# Altium schematic sheet SEC_3002_HL_Loop1.SchDoc
size 419 x 297 mm; SheetNumber: 3; SheetTotal: 4
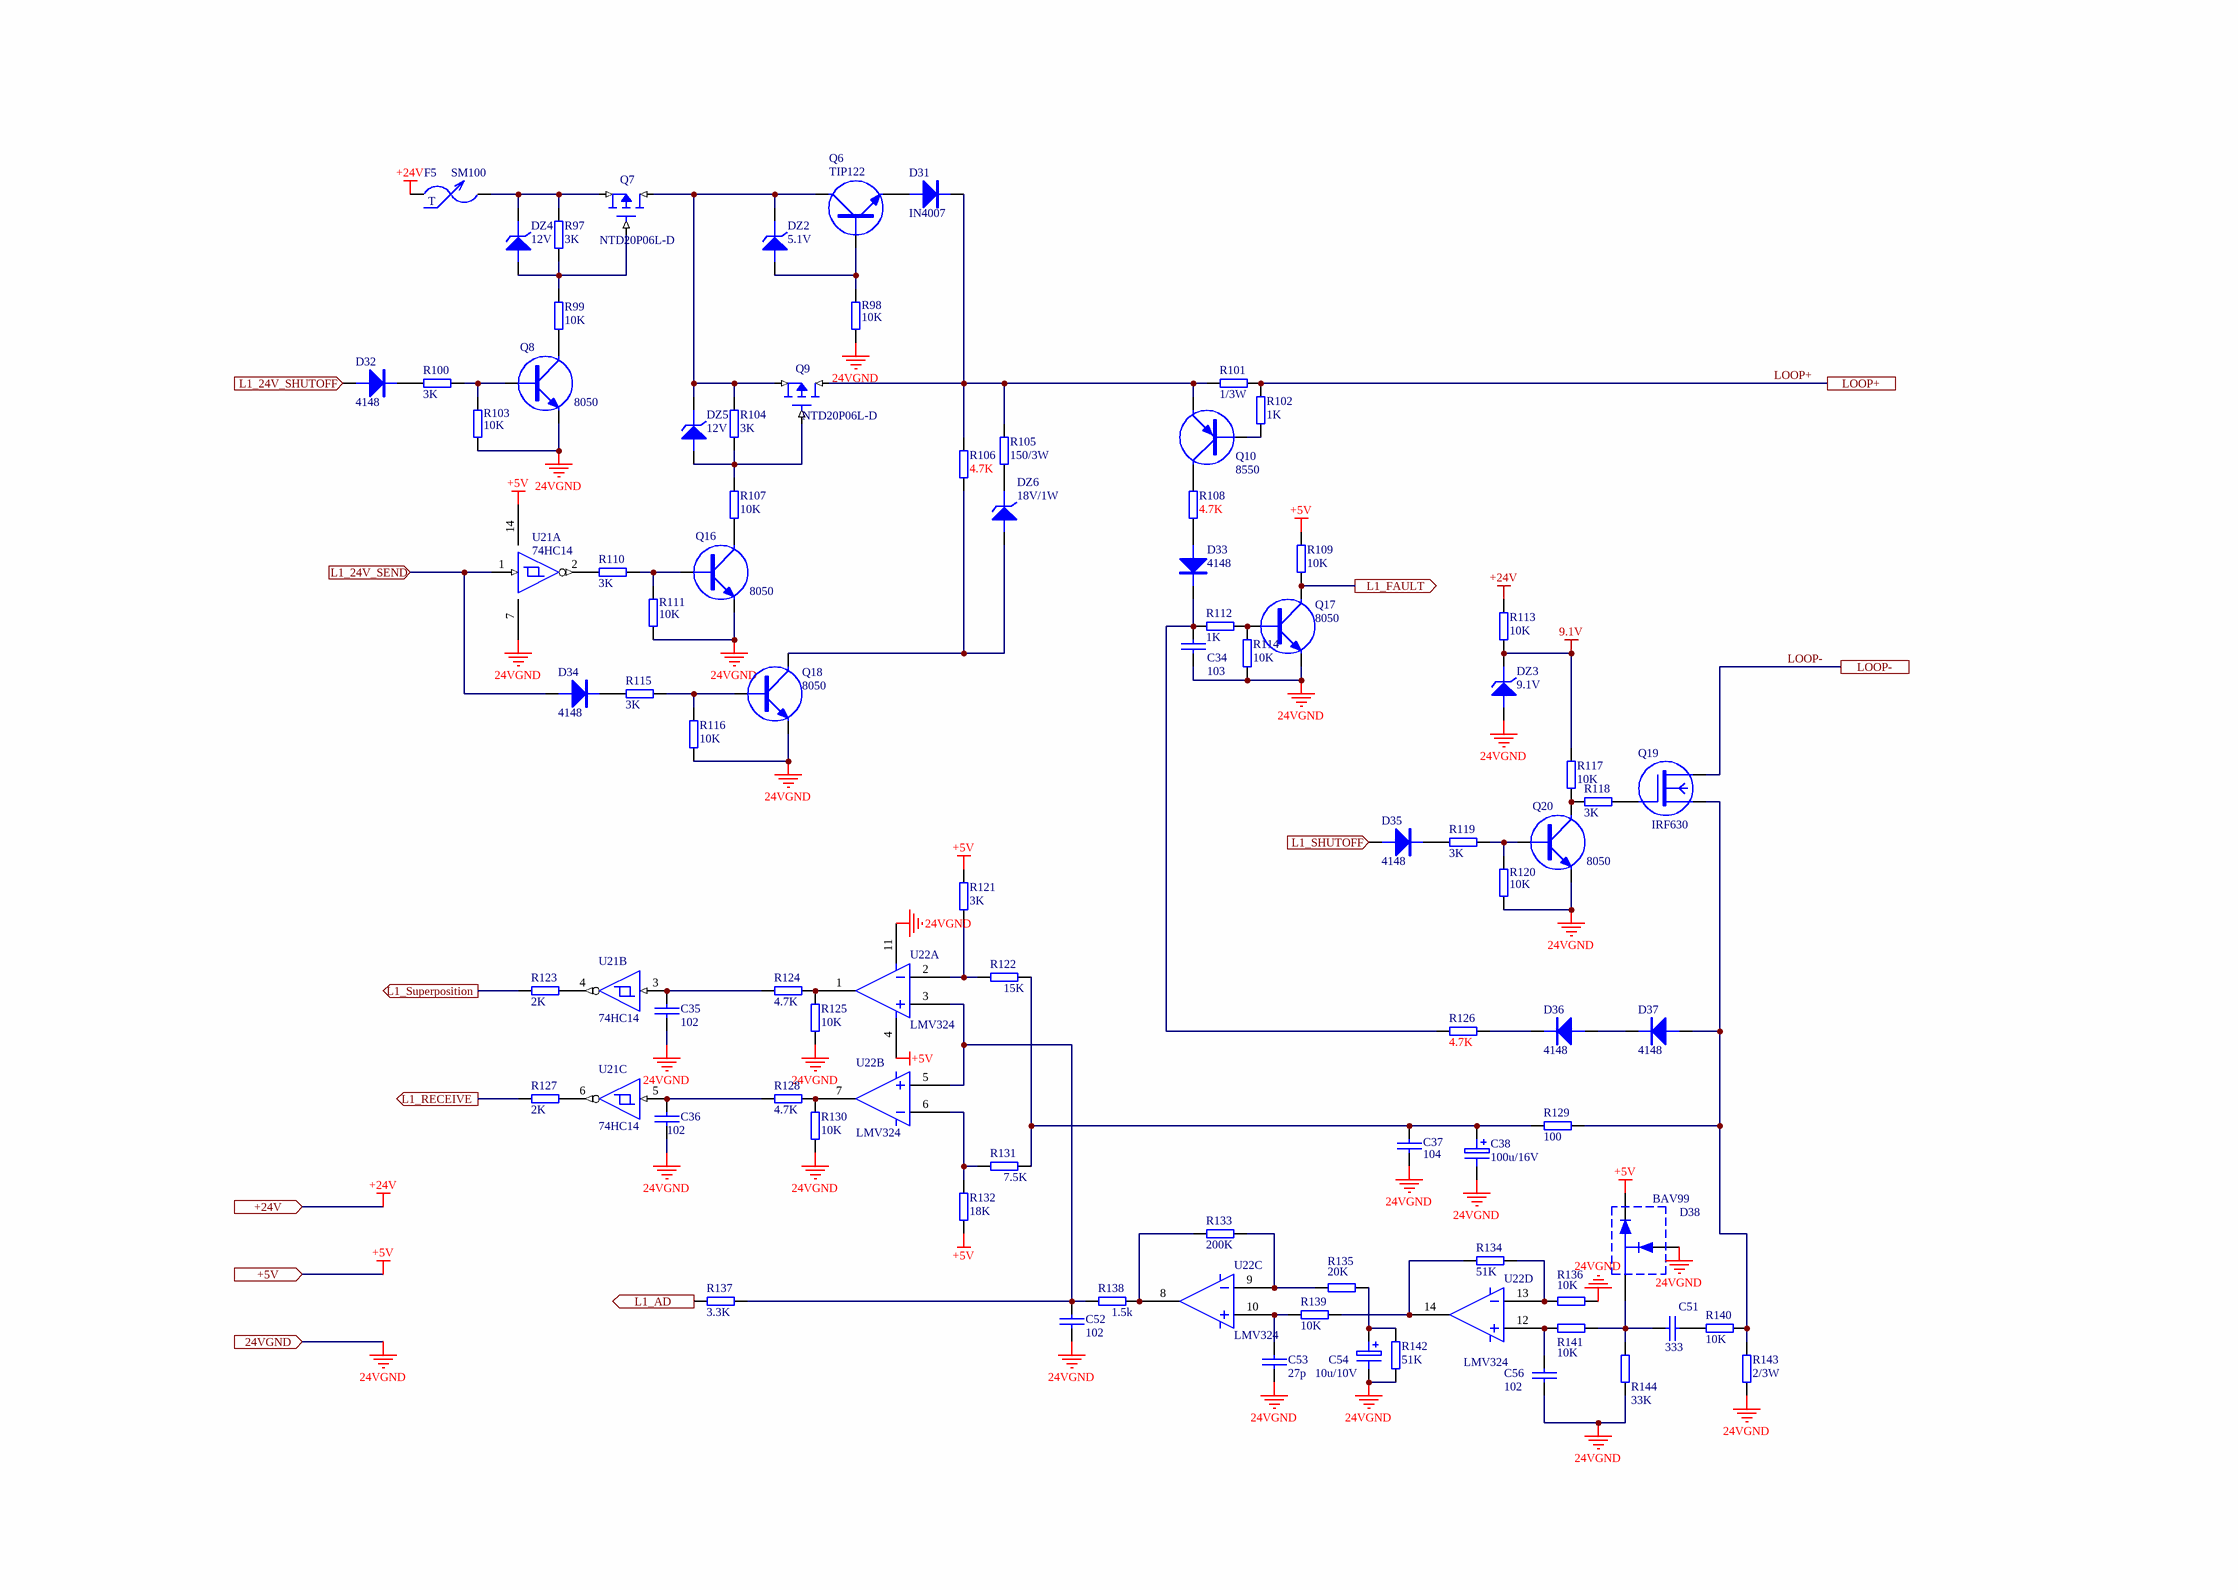
[diagram p0: SEC_3002_HL_Loop1.SchDoc]

## Parts
C34  103  [C-0603]
C35  102  [C-0603]
C36  102  [C-0603]
C37  104  [C-0603]
C38  100u/16V  [CAP--SMD--6.6*5.3]
C51  333  [C-0603]
C52  102  [C-0603]
C53  27p  [C-0603]
C54  10u/10V  [C-0805]
C56  102  [C-0603]
D31  IN4007  [4526D]
D32  4148  [1206D]
D33  4148  [1206D]
D34  4148  [1206D]
D35  4148  [1206D]
D36  4148  [1206D]
D37  4148  [1206D]
D38  BAV99  [SOT-23]
DZ2  5.1V  [1206D]
DZ3  9.1V  [1206D]
DZ4  12V  [1206D]
DZ5  12V  [1206D]
DZ6  18V/1W  [1206D]
F5  SM100  [SM100]
Q6  TIP122  [TO252-(BCE)]
Q7  NTD20P06L-D  [TO252-(GDS)]
Q8  8050  [SOT-23]
Q9  NTD20P06L-D  [TO252-(GDS)]
Q10  8550  [SOT-23]
Q16  8050  [SOT-23]
Q17  8050  [SOT-23]
Q18  8050  [SOT-23]
Q19  IRF630  [TO252-(GDS)]
Q20  8050  [SOT-23]
R97  3K  [R-0603]
R98  10K  [R-0603]
R99  10K  [R-0603]
R100  3K  [R-0603]
R101  1/3W  [AXIAL-0.8A]
R102  1K  [R-0603]
R103  10K  [R-0603]
R104  3K  [R-0603]
R105  150/3W  [AXIAL-0.8A]
R106  4.7K  [R-0603]
R107  10K  [R-0603]
R108  4.7K  [R-0603]
R109  10K  [R-0603]
R110  3K  [R-0603]
R111  10K  [R-0603]
R112  1K  [R-0603]
R113  10K  [R-0603]
R114  10K  [R-0603]
R115  3K  [R-0603]
R116  10K  [R-0603]
R117  10K  [R-0603]
R118  3K  [R-0603]
R119  3K  [R-0603]
R120  10K  [R-0603]
R121  3K  [R-0603]
R122  15K  [R-0603]
R123  2K  [R-0603]
R124  4.7K  [R-0603]
R125  10K  [R-0603]
R126  4.7K  [R-0603]
R127  2K  [R-0603]
R128  4.7K  [R-0603]
R129  100  [R-0603]
R130  10K  [R-0603]
R131  7.5K  [R-0603]
R132  18K  [R-0603]
R133  200K  [R-0603]
R134  51K  [R-0603]
R135  20K  [R-0603]
R136  10K  [R-0603]
R137  3.3K  [R-0603]
R138  1.5k  [R-0603]
R139  10K  [R-0603]
R140  10K  [R-0603]
R141  10K  [R-0603]
R142  51K  [R-0603]
R143  2/3W  [AXIAL-0.8A]
R144  33K  [R-0603]
U21  74HC14  [SO-14]  (parts A,B,C of 6)
U22  LMV324  [SO-14]  (parts A,B,C,D of 4)

## Ports
24VGND, +5V, +24V, L1_24V_SEND (in), L1_24V_SHUTOFF (in), L1_AD (out), L1_FAULT (out), L1_RECEIVE (out), L1_SHUTOFF (in), L1_Superposition (out), LOOP+, LOOP-

## Nets
9.1V: DZ3.K R113.1 R117.2
24VGND: C34.2 C35.2 C36.2 C37.1 C38.2 C52.2 C53.1 C54.2 C56.2 D38.B DZ3.A Q8.E Q16.E Q17.E Q18.E Q20.E R98.1 R103.1 R111.1 R114.1 R116.1 R120.1 R125.1 R130.1 R136.1 R142.2 R143.2 R144.2 U21.7(GND) U22.11 ; port 24VGND
+5V: D38.E R109.2 R121.1 R132.2 U21.14(VCC) U22.4 ; port +5V
+24V: F5.2 R113.2 ; port +24V
L1_24V_SEND: D34.A U21.1 ; port L1_24V_SEND
L1_24V_SHUTOFF: D32.A ; port L1_24V_SHUTOFF
L1_AD: R137.1 ; port L1_AD
L1_FAULT: Q17.C R109.1 ; port L1_FAULT
L1_RECEIVE: R127.2 ; port L1_RECEIVE
L1_SHUTOFF: D35.A ; port L1_SHUTOFF
L1_Superposition: R123.2 ; port L1_Superposition
LOOP+: R101.2 R102.2 ; port LOOP+
LOOP-: Q19.D ; port LOOP-
NetC34_1: C34.1 D33.K R112.2 R126.2
NetC35_1: C35.1 R124.2 U21.3
NetC36_1: C36.1 R128.2 U21.5
NetC37_2: C37.2 C38.1 R122.1 R129.2 R131.1
NetC51_1: C51.1 R140.2
NetC51_2: C51.2 D38.C R141.1 R144.1
NetC52_1: C52.1 R137.2 R138.2 U22.3 U22.5
NetC53_2: C53.2 R139.2 U22.10
NetC54_1: C54.1 R135.1 R142.1
NetC56_1: C56.1 R141.2 U22.12
NetD31_A: D31.A Q6.E
NetD31_K: D31.K Q9.D Q10.E R101.1 R105.1 R106.1
NetD32_K: D32.K R100.2
NetD33_A: D33.A R108.1
NetD34_K: D34.K R115.1
NetD35_K: D35.K R119.1
NetD36_A: D36.A D37.K
NetD36_K: D36.K R126.1
NetD37_A: D37.A Q19.S R129.1 R140.1 R143.1
NetDZ2_A: DZ2.A Q6.B R98.2
NetDZ2_K: DZ2.K DZ5.K Q6.C Q7.D Q9.S R104.2
NetDZ4_A: DZ4.A Q7.G R97.1 R99.2
NetDZ4_K: DZ4.K F5.1 Q7.S R97.2
NetDZ5_A: DZ5.A Q9.G R104.1 R107.2
NetDZ6_A: DZ6.A Q18.C R106.2
NetDZ6_K: DZ6.K R105.2
NetQ8_B: Q8.B R100.1 R103.2
NetQ8_C: Q8.C R99.1
NetQ10_B: Q10.B R102.1
NetQ10_C: Q10.C R108.2
NetQ16_B: Q16.B R110.1 R111.2
NetQ16_C: Q16.C R107.1
NetQ17_B: Q17.B R112.1 R114.2
NetQ18_B: Q18.B R115.2 R116.2
NetQ19_G: Q19.G R118.1
NetQ20_B: Q20.B R119.2 R120.2
NetQ20_C: Q20.C R117.1 R118.2
NetR110_2: R110.2 U21.2
NetR121_2: R121.2 R122.2 U22.2
NetR123_1: R123.1 U21.4
NetR124_1: R124.1 R125.2 U22.1
NetR127_1: R127.1 U21.6
NetR128_1: R128.1 R130.2 U22.7
NetR131_2: R131.2 R132.1 U22.6
NetR133_1: R133.1 R135.2 U22.9
NetR133_2: R133.2 R138.1 U22.8
NetR134_1: R134.1 R136.2 U22.13
NetR134_2: R134.2 R139.1 U22.14

## Notes on the sheet
- 媒体编号
- 旧底图总号
- 底图总号
- 拟  制
- 签 名
- 日 期
- 审  核
- 格式
- (3)
- 标记
- 制图
- 数量
- ：
- 更改单号
- 日期
- 描图
- 图幅
- 第        张
- (in symbol RXE110) T

## Library data of the parts
C34-C37 C51-C53 C56 = CAP: Capacitor
C38 C54 = ELECTRO1: Electrolytic Capacitor
D31-D37 = DIODE_A: Diode
DZ2-DZ6 = ZENER3: Zener Diode
F5 = RXE110: PTC
Q6 Q8 Q16-Q18 Q20 = NPN: NPN Transistor
Q7 Q9 = MOSFET-P: P-channel mosfet; L: *; W: *; AD: *; AS: *; PD: *; PS: *; NRD: *; NRS: *; NRG: *; NRB: *; M: *
Q10 = PNP_A: PNP Transistor
Q19 = MOSFET-N1
R97-R144 = RES2
U21 = 74LS14
U22 = LM124